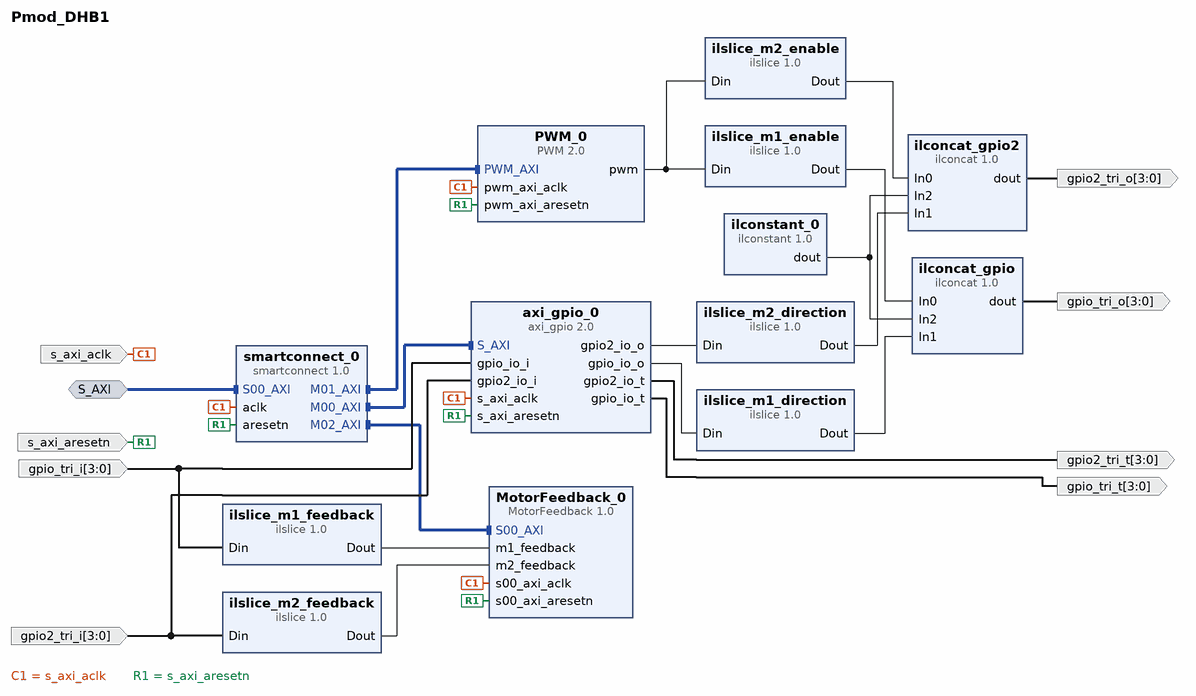
[diagram p0: block diagram of the top level]
# Vivado block design Pmod_DHB1, xc7a100tcsg324-1, Vivado 2024.2
create_bd_design Pmod_DHB1

create_bd_intf_port -mode Slave -vlnv xilinx.com:interface:aximm_rtl:1.0 S_AXI
set_property -dict [list \
  CONFIG.ADDR_WIDTH 32 \
  CONFIG.ARUSER_WIDTH 0 \
  CONFIG.AWUSER_WIDTH 0 \
  CONFIG.BUSER_WIDTH 0 \
  CONFIG.DATA_WIDTH 32 \
  CONFIG.HAS_BRESP 1 \
  CONFIG.HAS_BURST 1 \
  CONFIG.HAS_CACHE 1 \
  CONFIG.HAS_LOCK 1 \
  CONFIG.HAS_PROT 1 \
  CONFIG.HAS_QOS 1 \
  CONFIG.HAS_REGION 1 \
  CONFIG.HAS_RRESP 1 \
  CONFIG.HAS_WSTRB 1 \
  CONFIG.ID_WIDTH 0 \
  CONFIG.MAX_BURST_LENGTH 256 \
  CONFIG.NUM_READ_OUTSTANDING 1 \
  CONFIG.NUM_READ_THREADS 1 \
  CONFIG.NUM_WRITE_OUTSTANDING 1 \
  CONFIG.NUM_WRITE_THREADS 1 \
  CONFIG.PROTOCOL AXI4 \
  CONFIG.READ_WRITE_MODE READ_WRITE \
  CONFIG.RUSER_BITS_PER_BYTE 0 \
  CONFIG.RUSER_WIDTH 0 \
  CONFIG.SUPPORTS_NARROW_BURST 1 \
  CONFIG.WUSER_BITS_PER_BYTE 0 \
  CONFIG.WUSER_WIDTH 0 \
] [get_bd_intf_ports S_AXI]
create_bd_port -dir I -type clk s_axi_aclk
create_bd_port -dir I -type rst s_axi_aresetn
create_bd_port -dir I -from 3 -to 0 gpio_tri_i
create_bd_port -dir I -from 3 -to 0 gpio2_tri_i
create_bd_port -dir O -from 3 -to 0 gpio_tri_o
create_bd_port -dir O -from 3 -to 0 gpio2_tri_o
create_bd_port -dir O -from 3 -to 0 gpio_tri_t
create_bd_port -dir O -from 3 -to 0 gpio2_tri_t

create_bd_cell -type ip -vlnv xilinx.com:ip:smartconnect:1.0 smartconnect_0
set_property -dict {CONFIG.NUM_MI 3 CONFIG.NUM_SI 1} [get_bd_cells smartconnect_0]
create_bd_cell -type ip -vlnv xilinx.com:ip:axi_gpio:2.0 axi_gpio_0
set_property -dict [list \
  CONFIG.C_GPIO2_WIDTH 4 \
  CONFIG.C_GPIO_WIDTH 4 \
  CONFIG.C_IS_DUAL 1 \
  CONFIG.C_TRI_DEFAULT 0xFFFFFFFC \
  CONFIG.C_TRI_DEFAULT_2 0xFFFFFFFC \
] [get_bd_cells axi_gpio_0]
create_bd_cell -type inline_hdl -vlnv xilinx.com:inline_hdl:ilslice:1.0 ilslice_m1_direction
set_property -dict {CONFIG.DIN_WIDTH 4} [get_bd_cells ilslice_m1_direction]
create_bd_cell -type inline_hdl -vlnv xilinx.com:inline_hdl:ilslice:1.0 ilslice_m2_direction
set_property -dict {CONFIG.DIN_WIDTH 4} [get_bd_cells ilslice_m2_direction]
create_bd_cell -type inline_hdl -vlnv xilinx.com:inline_hdl:ilconcat:1.0 ilconcat_gpio
set_property -dict {CONFIG.NUM_PORTS 3} [get_bd_cells ilconcat_gpio]
create_bd_cell -type inline_hdl -vlnv xilinx.com:inline_hdl:ilconcat:1.0 ilconcat_gpio2
set_property -dict {CONFIG.NUM_PORTS 3} [get_bd_cells ilconcat_gpio2]
create_bd_cell -type ip -vlnv digilentinc.com:IP:PWM:2.0 PWM_0
set_property -dict {CONFIG.NUM_PWM 2} [get_bd_cells PWM_0]
create_bd_cell -type inline_hdl -vlnv xilinx.com:inline_hdl:ilslice:1.0 ilslice_m1_enable
set_property -dict {CONFIG.DIN_WIDTH 2} [get_bd_cells ilslice_m1_enable]
create_bd_cell -type inline_hdl -vlnv xilinx.com:inline_hdl:ilslice:1.0 ilslice_m2_enable
set_property -dict {CONFIG.DIN_FROM 1 CONFIG.DIN_TO 1 CONFIG.DIN_WIDTH 2} [get_bd_cells ilslice_m2_enable]
create_bd_cell -type inline_hdl -vlnv xilinx.com:inline_hdl:ilconstant:1.0 ilconstant_0
set_property -dict {CONFIG.CONST_VAL 0 CONFIG.CONST_WIDTH 2} [get_bd_cells ilconstant_0]
create_bd_cell -type ip -vlnv digilentinc.com:IP:MotorFeedback:1.0 MotorFeedback_0
create_bd_cell -type inline_hdl -vlnv xilinx.com:inline_hdl:ilslice:1.0 ilslice_m1_feedback
set_property -dict {CONFIG.DIN_FROM 3 CONFIG.DIN_TO 3 CONFIG.DIN_WIDTH 4} [get_bd_cells ilslice_m1_feedback]
create_bd_cell -type inline_hdl -vlnv xilinx.com:inline_hdl:ilslice:1.0 ilslice_m2_feedback
set_property -dict {CONFIG.DIN_FROM 3 CONFIG.DIN_TO 3 CONFIG.DIN_WIDTH 4} [get_bd_cells ilslice_m2_feedback]

# ---- connections ----

connect_bd_intf_net -intf_net S_AXI_0_1 [get_bd_intf_ports S_AXI] [get_bd_intf_pins smartconnect_0/S00_AXI]
connect_bd_intf_net [get_bd_intf_pins smartconnect_0/M00_AXI] [get_bd_intf_pins axi_gpio_0/S_AXI]
connect_bd_intf_net [get_bd_intf_pins PWM_0/PWM_AXI] [get_bd_intf_pins smartconnect_0/M01_AXI]
connect_bd_intf_net [get_bd_intf_pins MotorFeedback_0/S00_AXI] [get_bd_intf_pins smartconnect_0/M02_AXI]
connect_bd_net [get_bd_pins PWM_0/pwm] [get_bd_pins ilslice_m1_enable/Din] [get_bd_pins ilslice_m2_enable/Din]
connect_bd_net [get_bd_pins axi_gpio_0/gpio2_io_o] [get_bd_pins ilslice_m2_direction/Din]
connect_bd_net [get_bd_pins axi_gpio_0/gpio2_io_t] [get_bd_ports gpio2_tri_t]
connect_bd_net [get_bd_pins axi_gpio_0/gpio_io_o] [get_bd_pins ilslice_m1_direction/Din]
connect_bd_net [get_bd_pins axi_gpio_0/gpio_io_t] [get_bd_ports gpio_tri_t]
connect_bd_net -net gpio2_io_i_1 [get_bd_ports gpio2_tri_i] [get_bd_pins axi_gpio_0/gpio2_io_i] [get_bd_pins ilslice_m2_feedback/Din]
connect_bd_net -net gpio_io_i_1 [get_bd_ports gpio_tri_i] [get_bd_pins axi_gpio_0/gpio_io_i] [get_bd_pins ilslice_m1_feedback/Din]
connect_bd_net [get_bd_pins ilconcat_gpio2/dout] [get_bd_ports gpio2_tri_o]
connect_bd_net [get_bd_pins ilconcat_gpio/dout] [get_bd_ports gpio_tri_o]
connect_bd_net [get_bd_pins ilconstant_0/dout] [get_bd_pins ilconcat_gpio2/In2] [get_bd_pins ilconcat_gpio/In2]
connect_bd_net -net ilslice_DIR1_Dout [get_bd_pins ilslice_m1_direction/Dout] [get_bd_pins ilconcat_gpio/In1]
connect_bd_net -net ilslice_DIR2_Dout [get_bd_pins ilslice_m2_direction/Dout] [get_bd_pins ilconcat_gpio2/In1]
connect_bd_net -net ilslice_EN1_Dout [get_bd_pins ilslice_m1_enable/Dout] [get_bd_pins ilconcat_gpio/In0]
connect_bd_net -net ilslice_EN2_Dout [get_bd_pins ilslice_m2_enable/Dout] [get_bd_pins ilconcat_gpio2/In0]
connect_bd_net [get_bd_pins ilslice_m1_feedback/Dout] [get_bd_pins MotorFeedback_0/m1_feedback]
connect_bd_net [get_bd_pins ilslice_m2_feedback/Dout] [get_bd_pins MotorFeedback_0/m2_feedback]
connect_bd_net -net s_axi_aclk_0_1 [get_bd_ports s_axi_aclk] \
  [get_bd_pins smartconnect_0/aclk] [get_bd_pins axi_gpio_0/s_axi_aclk] [get_bd_pins PWM_0/pwm_axi_aclk] \
  [get_bd_pins MotorFeedback_0/s00_axi_aclk]
connect_bd_net -net s_axi_aresetn_0_1 [get_bd_ports s_axi_aresetn] \
  [get_bd_pins smartconnect_0/aresetn] [get_bd_pins axi_gpio_0/s_axi_aresetn] [get_bd_pins PWM_0/pwm_axi_aresetn] \
  [get_bd_pins MotorFeedback_0/s00_axi_aresetn]

# ---- address map ----
assign_bd_address -offset 0x00000000 -range 64K -target_address_space [get_bd_addr_spaces S_AXI] [get_bd_addr_segs axi_gpio_0/S_AXI/Reg]
assign_bd_address -offset 0x00010000 -range 64K -target_address_space [get_bd_addr_spaces S_AXI] [get_bd_addr_segs PWM_0/PWM_AXI/PWM_AXI_reg]
assign_bd_address -offset 0x00020000 -range 64K -target_address_space [get_bd_addr_spaces S_AXI] [get_bd_addr_segs MotorFeedback_0/S00_AXI/S00_AXI_reg]

validate_bd_design
save_bd_design
